# Altium schematic sheet FPGA_Conf.SchDoc: FPGA CONFIGURATION
size A4; DocumentNumber: 9; SheetNumber: 9; SheetTotal: 18
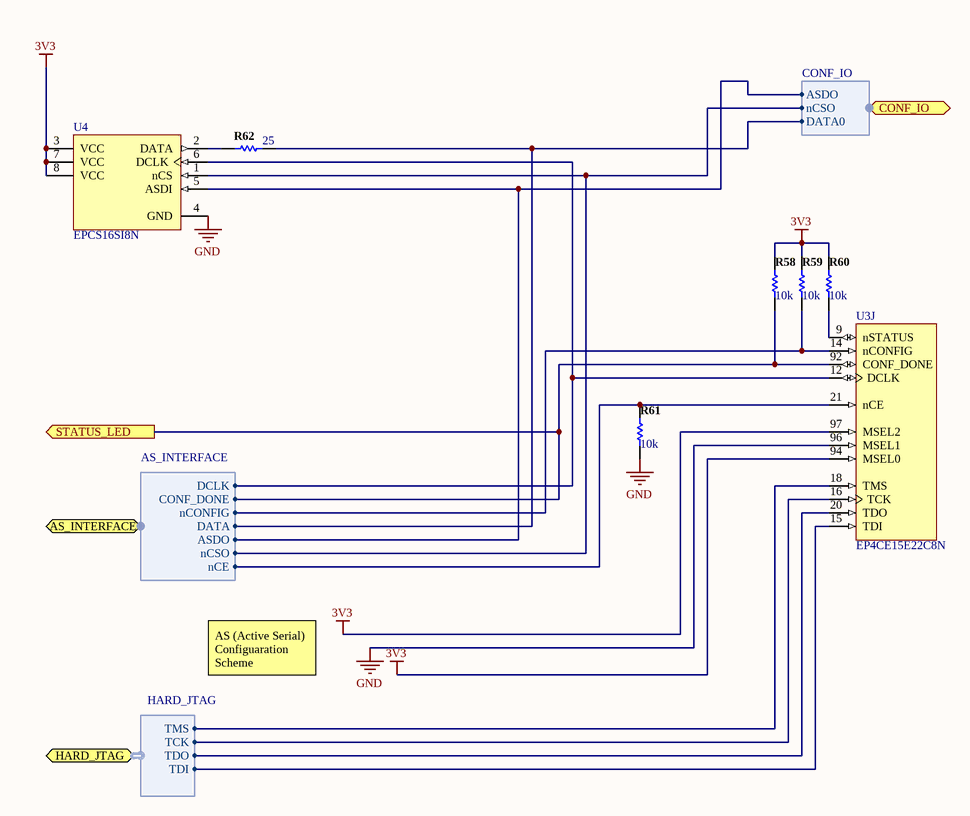
[diagram p0: FPGA_Conf.SchDoc]

## Parts
R58  10k  [0805R-10K]
R59  10k  [0805R-10K]
R60  10k  [0805R-10K]
R61  10k  [0805R-10K]
R62  25  [0805R-0R1]
U3  EP4CE15E22C8N  [EQFP144_A-165_D2-67_N]  (part J of 13)
U4  EPCS16SI8N  [SOIC8_N]

## Ports
AS_INTERFACE (harness AS_INTERFACE), CONF_IO (harness CONF_IO), HARD_JTAG (harness HARD_JTAG), STATUS_LED (out)

## Harnesses
HARD_JTAG: TCK, TDI, TDO, TMS
AS_INTERFACE: DCLK, CONF_DONE, nCONFIG, ASDO, nCE, nCSO, DATA
CONF_IO: ASDO, nCSO, DATA0

## Nets
3V3: R58.1 R59.1 R60.1 U3.94(MSEL0) U3.97(MSEL2) U4.3(VCC) U4.7(VCC) U4.8(VCC)
GND: R61.2 U3.96(MSEL1) U4.4(GND)
STATUS_LED: R58.2 U3.92(CONF_DONE) ; port STATUS_LED, port AS_INTERFACE.CONF_DONE
NetR59_2: R59.2 U3.14(nCONFIG) ; port AS_INTERFACE.nCONFIG
NetR60_2: R60.2 U3.9(nSTATUS)
NetR61_1: R61.1 U3.21(nCE) ; port AS_INTERFACE.nCE
NetR62_1: R62.1 U4.2(DATA)
NetR62_2: R62.2 ; port AS_INTERFACE.DATA, port CONF_IO.DATA0
NetU3_12: U3.12(DCLK) U4.6(DCLK) ; port AS_INTERFACE.DCLK
NetU3_15: U3.15(TDI) ; port HARD_JTAG.TDI
NetU3_16: U3.16(TCK) ; port HARD_JTAG.TCK
NetU3_18: U3.18(TMS) ; port HARD_JTAG.TMS
NetU3_20: U3.20(TDO) ; port HARD_JTAG.TDO
NetU4_1: U4.1(nCS) ; port AS_INTERFACE.nCSO, port CONF_IO.nCSO
NetU4_5: U4.5(ASDI) ; port AS_INTERFACE.ASDO, port CONF_IO.ASDO

## Notes on the sheet
- AS (Active Serial) Configuaration Scheme
- Title
- Size:
- Date:
- A4
- Number:
- Time:
- Revision:
- Sheet
- of
- File:

## Library data of the parts
R58-R62 = D-100-0116: Tolerance: 1 %; Mounting Technology: Surface Mount; Status: Production; Category: Resistor
  R58-R61: Value: 10k
  R62: Value: 25
U3 = EP4CE15E22C8N: Cyclone IV Family FPGA, 1.2V Core, 81 I/O Pins, 4 PLLs, 144-Pin QFP, Speed Grade 8, Commercial Grade, Pb-Free; Manufacturer: Altera; DatasheetVersion: ver1.6, Nov-2011; PackageVersion: ver1.0, Jun-2011; PackageReference: EQFP144_A-165_D2-67; PackageDescription: 144-Pin Plastic Enhanced Quad Flat Pack (EQFP) - Wire Bond - A:1.65 - D2:6.7; Code_JEDEC: MS-026-BFB-HD; ComponentLink1Description: Manufacturer URL; ComponentLink1URL: http://www.altera.com/; ComponentLink2Description: Handbook; ComponentLink2URL: http://www.altera.com/literature/hb/cyclone-iv/cyclone4-handbook.pdf; ComponentLink3Description: Pinout; ComponentLink3URL: http://www.altera.com/literature/lit-dp.jsp?category=cyc%204&showspreadsheet=y; ComponentLink4Description: Package Specification; ComponentLink4URL: http://www.altera.com/devicepackaging/04R00221-02.pdf
U4 = EPCS16SI8N: EPCS16 Series, In-system programmable 3.3V serial configuration device, 8-Pin SOIC, 16-Megabit, Industrial Grade, Pb-Free; Configures: All Arria series, all Cyclone series and all Stratix series (except Stratix); DatasheetVersion: ver3.0, Dec-2009; PackageVersion: ver14.2, Oct-2005; PackageReference: SOIC8; PackageDescription: 8-Pin Small Outline Integrated Circuit Package (SOIC8); Code_JEDEC: MS-012-AA; Code_IPC: SOIC127P600-8; ComponentLink1Description: Manufacturer URL; ComponentLink1URL: http://www.altera.com/; ComponentLink2Description: Configuration Handbook; ComponentLink2URL: http://www.altera.com/literature/hb/cfg/config_handbook.pdf; ComponentLink3Description: Pinout; ComponentLink3URL: http://www.altera.com/literature/hb/cfg/config_handbook.pdf; ComponentLink4Description: Package Specification; ComponentLink4URL: http://www.altera.com/support/devices/packaging/specifications/pkg-pin/pdf/016-SOIC.pdf